# EAGLE design Zusatzplatine (EAGLE 7.4.0)
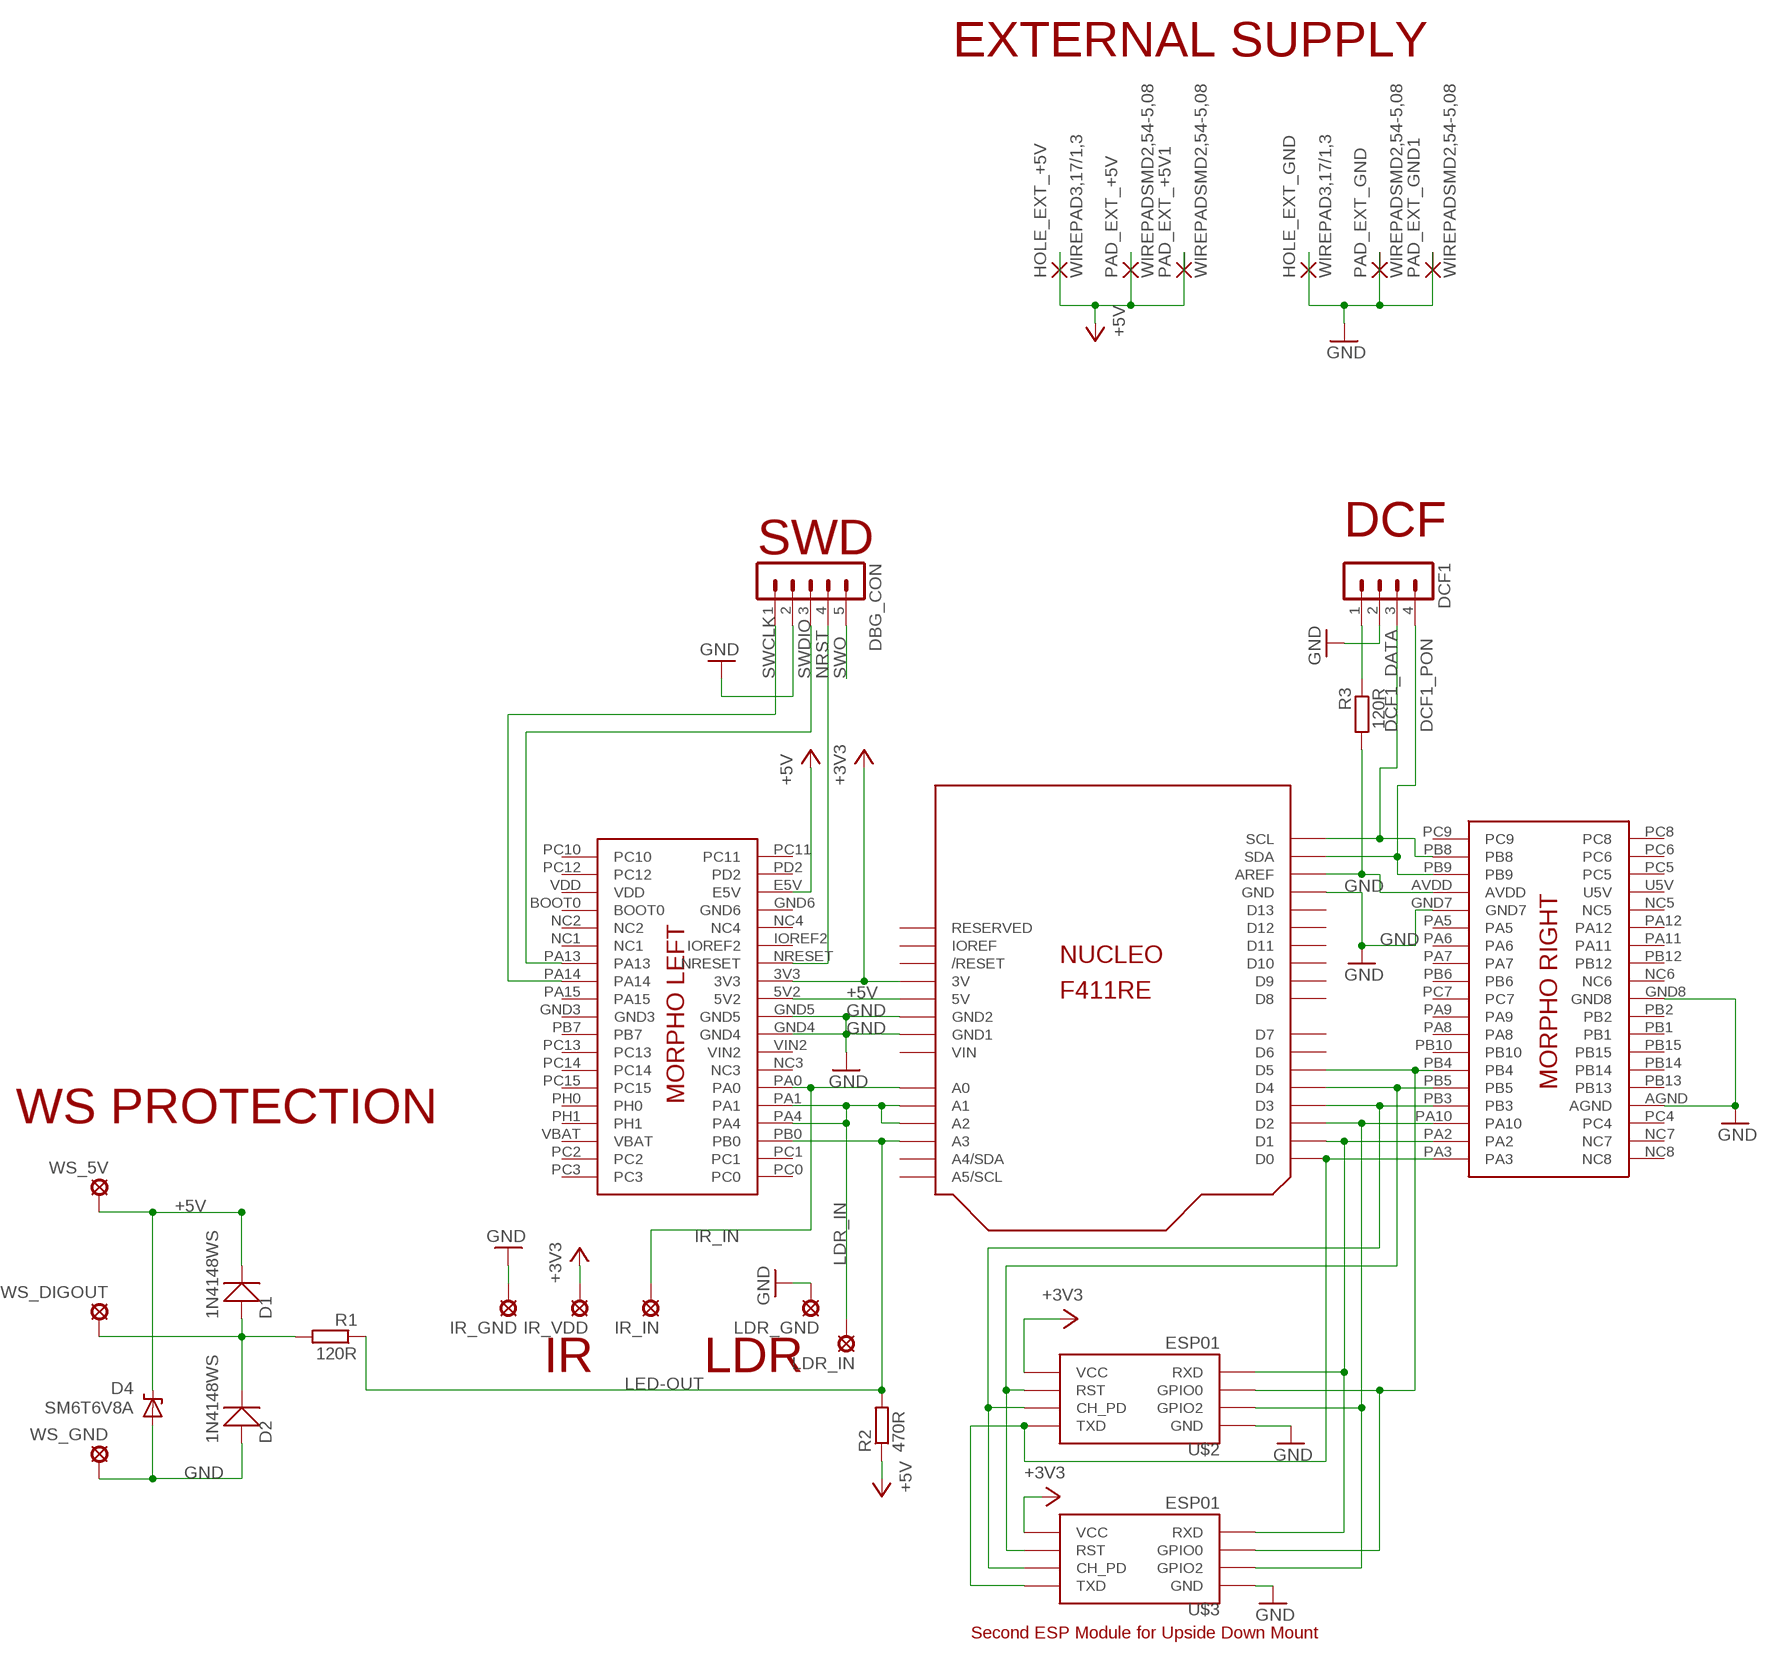
[diagram p0: schematic, sheet 1]

## Parts
D1  1N4148WS  [SOD-323]
D2  1N4148WS  [SOD-323]
D4  SM6T6V8A  SUPPRESSOR-SMBJ  [SMBJ]
DBG_CON  MA05-1  [MA05-1]
DCF1  MA04-1  [MA04-1]
HOLE_EXT_+5V  WIREPAD3,17/1,3  [3,17/1,3]
HOLE_EXT_GND  WIREPAD3,17/1,3  [3,17/1,3]
IR_GND  SE14  [SE14]
IR_IN  SE14  [SE14]
IR_VDD  SE14  [SE14]
LDR_GND  SE14  [SE14]
LDR_IN  SE14  [SE14]
PAD_EXT_+5V  WIREPADSMD2,54-5,08  [SMD2,54-5,08]
PAD_EXT_+5V1  WIREPADSMD2,54-5,08  [SMD2,54-5,08]
PAD_EXT_GND  WIREPADSMD2,54-5,08  [SMD2,54-5,08]
PAD_EXT_GND1  WIREPADSMD2,54-5,08  [SMD2,54-5,08]
R1  120R  R-EU_R1206  [R1206]
R2  470R  R-EU_R1206  [R1206]
R3  120R  R-EU_R1206  [R1206]
U$1  NUCLEO_F411RE  [NUCLEO_BRD64]
U$2  ESP01  [ESP01]
U$3  ESP01  [ESP01]
WS_5V  SE14  [SE14]
WS_DIGOUT  SE14  [SE14]
WS_GND  SE14  [SE14]

## Nets
+3V3: IR_VDD.MP U$1.3V U$1.3V3 U$2.VCC U$3.VCC
+5V: D1.1 D4.C HOLE_EXT_+5V.1(P) PAD_EXT_+5V1.1(P) PAD_EXT_+5V.1(P) R2.1 U$1.5V U$1.5V2 U$1.E5V WS_5V.MP
DCF1_DATA: DCF1.3 U$1.PB8 U$1.SCL
DCF1_PON: DCF1.4 U$1.PB9 U$1.SDA
GND: D2.0 D4.A DBG_CON.2 DCF1.2 HOLE_EXT_GND.1(P) IR_GND.MP LDR_GND.MP PAD_EXT_GND1.1(P) PAD_EXT_GND.1(P) U$1.AGND U$1.GND U$1.GND1 U$1.GND2 U$1.GND4 U$1.GND5 U$1.GND7 U$1.GND8 U$2.GND U$3.GND WS_GND.MP
IR_IN: IR_IN.MP U$1.A0 U$1.PA0
LDR_IN: LDR_IN.MP U$1.A1 U$1.A2 U$1.PA1 U$1.PA4
LED-OUT: R1.1 R2.2 U$1.A3 U$1.PB0
N$1: R3.2 U$1.AREF U$1.AVDD
N$2: DCF1.1 R3.1
N$8: D1.0 D2.1 R1.2 WS_DIGOUT.MP
N$12: U$1.D5 U$1.PB4 U$2.GPIO0 U$3.GPIO0
N$13: U$1.D4 U$1.PB5 U$2.RST U$3.RST
N$14: U$1.D3 U$1.PB3 U$2.CH_PD U$3.CH_PD
N$15: U$1.D0 U$1.PA3 U$2.TX(TXD) U$3.TX(TXD)
N$16: U$1.D1 U$1.PA2 U$2.RX(RXD) U$3.RX(RXD)
N$17: U$1.D2 U$1.PA10 U$2.GPIO2 U$3.GPIO2
NRST: DBG_CON.4 U$1.NRESET
SWCLK: DBG_CON.1 U$1.PA14
SWDIO: DBG_CON.3 U$1.PA13
SWO: DBG_CON.5
Unconnected: U$1.A4(A4/SDA) U$1.A5(A5/SCL) U$1.BOOT0 U$1.D6 U$1.D7 U$1.D8 U$1.D9 U$1.D10 U$1.D11 U$1.D12 U$1.D13 U$1.IOREF U$1.IOREF2 U$1.NC1 U$1.NC2 U$1.NC3 U$1.NC4 U$1.NC5 U$1.NC6 U$1.NC7 U$1.NC8 U$1.PA5 U$1.PA6 U$1.PA7 U$1.PA8 U$1.PA9 U$1.PA11 U$1.PA12 U$1.PA15 U$1.PB1 U$1.PB2 U$1.PB6 U$1.PB7 U$1.PB10 U$1.PB12 U$1.PB13 U$1.PB14 U$1.PB15 U$1.PC0 U$1.PC1 U$1.PC2 U$1.PC3 U$1.PC4 U$1.PC5 U$1.PC6 U$1.PC7 U$1.PC8 U$1.PC9 U$1.PC10 U$1.PC11 U$1.PC12 U$1.PC13 U$1.PC14 U$1.PC15 U$1.PD2 U$1.PH0 U$1.PH1 U$1.RESERVED U$1.RESET(/RESET)

## Notes on the sheet
- EXTERNAL SUPPLY
- DCF
- SWD
- WS PROTECTION
- IR | LDR
- Second ESP Module for Upside Down Mount

## Power pins joined to a net without a drawn wire
GND3: U$1.GND3
GND6: U$1.GND6
U5V: U$1.U5V
VBAT: U$1.VBAT
VDD: U$1.VDD
VIN: U$1.VIN
VIN2: U$1.VIN2

## Library data of the parts
D1 D2 = Diodes:1N4148WS
D4 = diode:SUPPRESSOR-: Suppressor diode
DBG_CON = con-lstb:MA05-1: PIN HEADER; OC_FARNELL: unknown; OC_NEWARK: unknown
DCF1 = con-lstb:MA04-1: PIN HEADER; OC_FARNELL: unknown; OC_NEWARK: unknown
HOLE_EXT_+5V HOLE_EXT_GND PAD_EXT_+5V PAD_EXT_+5V1 PAD_EXT_GND PAD_EXT_GND1 = wirepad:WIREPAD: Wire PAD connect wire on PCB
IR_GND IR_IN IR_VDD LDR_GND LDR_IN WS_5V WS_DIGOUT WS_GND = solpad:SE14: SOLDER PAD E1553, drill 1,4mm, distributor Buerklin, 07F820
R1-R3 = rcl:R-EU_: RESISTOR, European symbol
U$1 = Stm32nucleo:NUCLEO_F411RE
U$2 U$3 = esp8266modules:ESP01: ESP8266 Wifi module 01

## Board
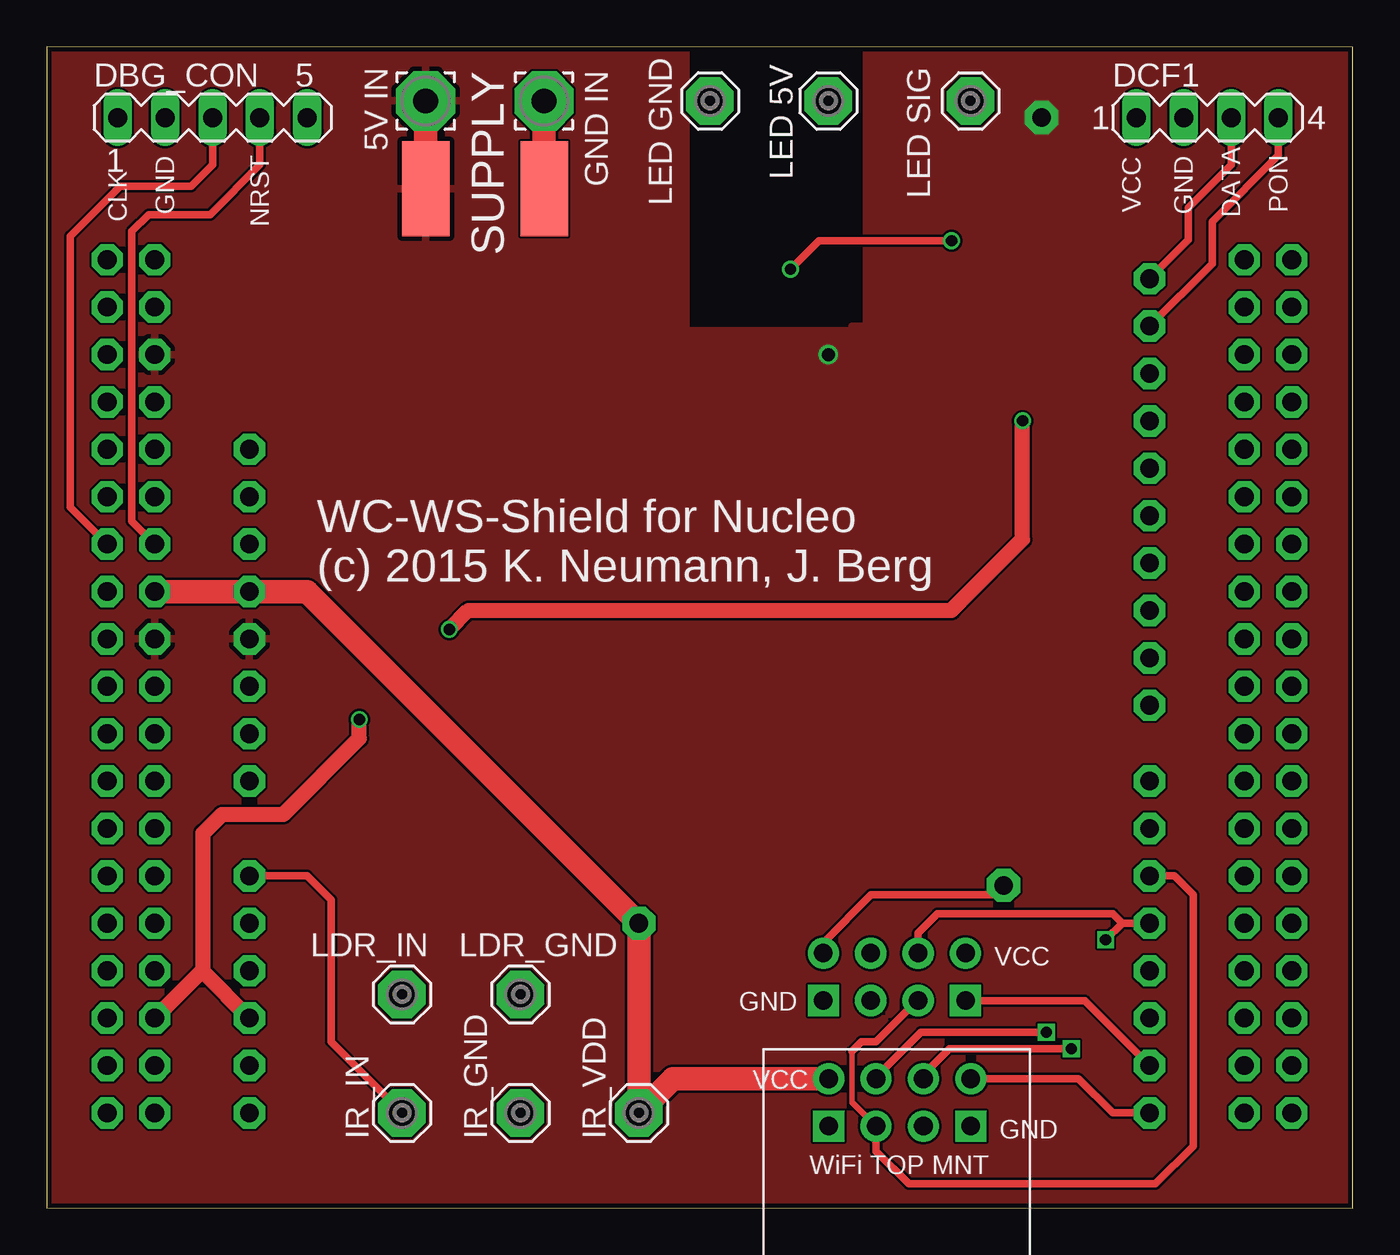
[diagram p1: board, top side]
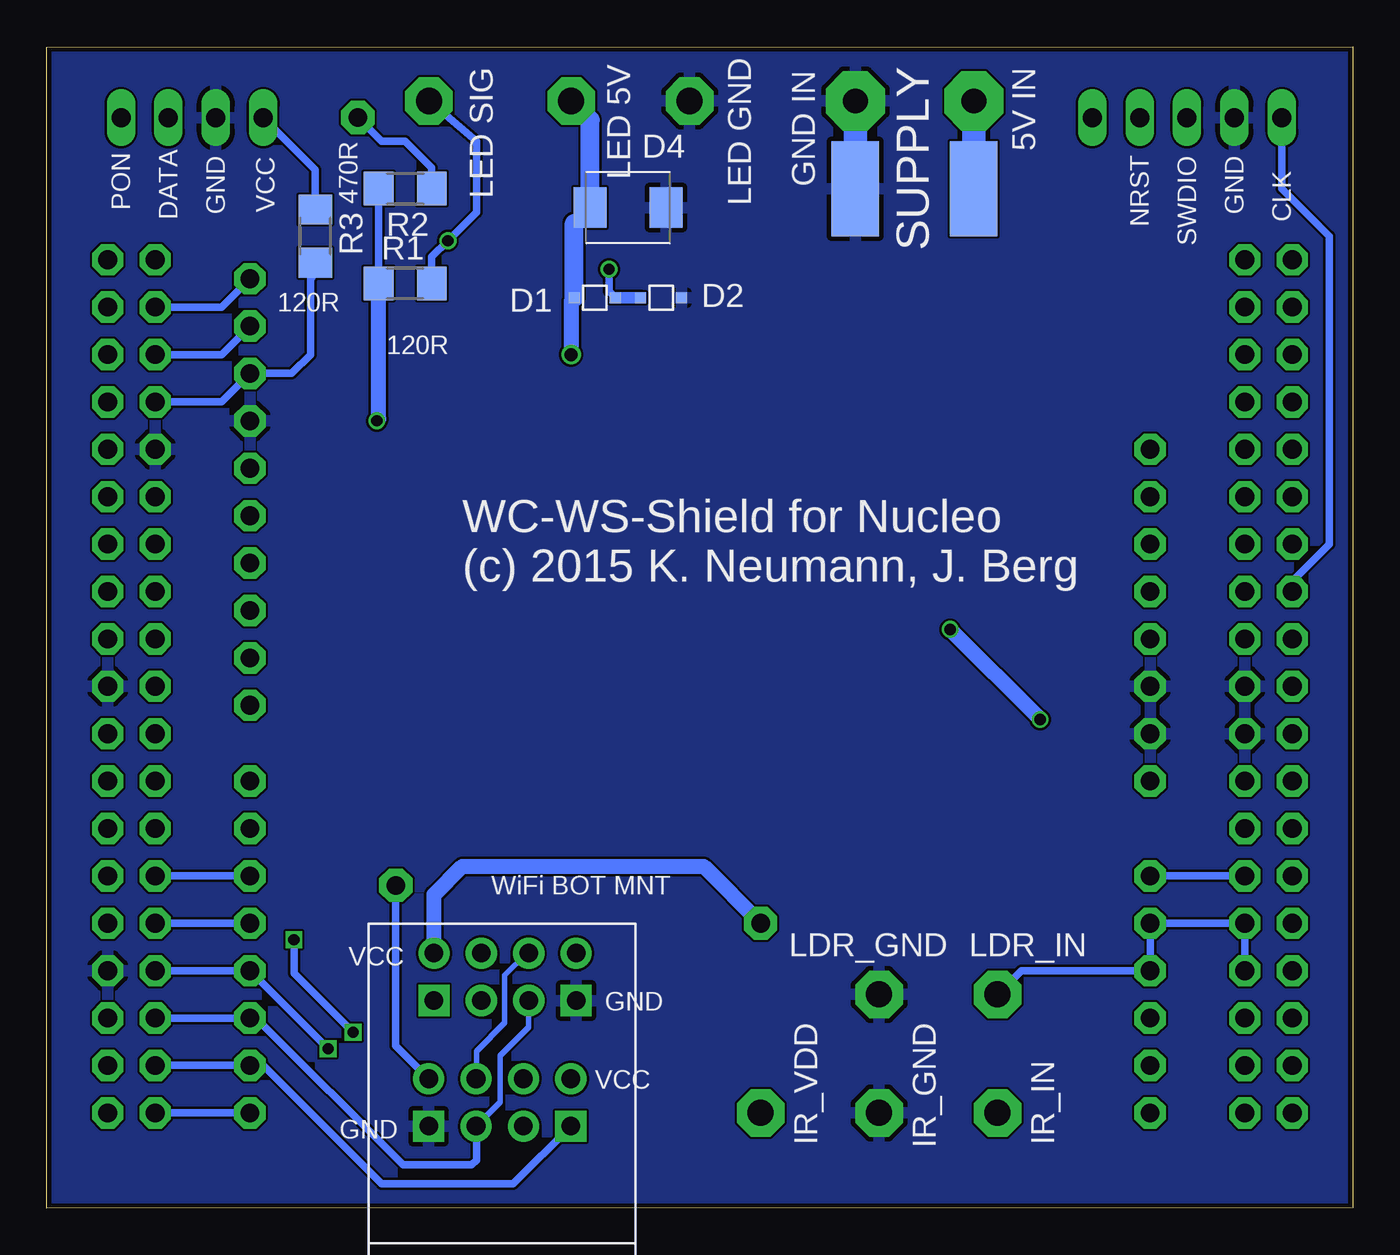
[diagram p2: board, bottom side, seen from below]

Size 70.03 x 62.24 mm. Coordinates in mm from the lower left corner, seen from the top.
Outline: 0,0.02 70.03,0 70.03,62.22 0,62.24 0,0.02
Copper layers (1*16): Top 0.035mm / dielectric 1.5mm / Bottom 0.035mm
Design rules "dirt_cheap_dirty_boards.v1": minimum track width 5mil, minimum drill 12mil, track to track 5mil, track to pad 5mil, pad to pad 5mil, via to via 5mil, smd to smd 0mil, copper to edge 10mil, drill to drill 10mil, minimum pad ring 10mil, minimum via ring 6mil, stop-mask expansion 2mil, vias tented up to drill 25mil, thermal gap 10mil

### Footprints (pad centres in the part's own frame; a part is rotated, then mirrored left to right if it is on the bottom)
SOD-323 = smd 0.6 x 0.6: 0 -1.1,0; 1 1.1,0
SMBJ = smd 1.78 x 2.16: A 2.04,0; C -2.03,0
MA05-1 = drill 1.016 long: 1 -5.08,0; 2 -2.54,0; 3 0,0; 4 2.54,0; 5 5.08,0
MA04-1 = drill 1.016 long: 1 -3.81,0; 2 -1.27,0; 3 1.27,0; 4 3.81,0
3,17/1,3 = drill 1.321 pad 3.175 octagon: 1 0,0
SE14 = drill 1.397 pad 2.54 octagon: MP 0,0
SMD2,54-5,08 = smd 2.54 x 5.08: 1 0,0
R1206 = smd 1.6 x 1.803: 1 -1.422,0; 2 1.422,0
NUCLEO_BRD64 = drill 1 pad 1.676 octagon: 3V 10.87,33.02; 3V3 5.79,33.02; 5V 10.87,30.48; 5V2 5.79,30.48; A0 10.87,17.78; A1 10.87,15.24; A2 10.87,12.7; A3 10.87,10.16; A4 10.87,7.62; A5 10.87,5.08; AGND 66.75,12.7; AREF 59.13,44.704; AVDD 64.21,43.18; BOOT0 3.25,43.18; D0 59.13,5.08; D1 59.13,7.62; D2 59.13,10.16; D3 59.13,12.7; D4 59.13,15.24; D5 59.13,17.78; D6 59.13,20.32; D7 59.13,22.86; D8 59.13,26.924; D9 59.13,29.464; D10 59.13,32.004; D11 59.13,34.544; D12 59.13,37.084; D13 59.13,39.624; E5V 5.79,45.72; GND 59.13,42.164; GND1 10.87,25.4; GND2 10.87,27.94; GND3 3.25,27.94; GND4 5.79,25.4; GND5 5.79,27.94; GND6 5.79,43.18; GND7 64.21,40.64; GND8 66.75,27.94; IOREF 10.87,38.1; IOREF2 5.79,38.1; NC1 3.25,38.1; NC2 3.25,40.64; NC3 5.79,20.32; NC4 5.79,40.64; NC5 66.75,40.64; NC6 66.75,30.48; NC7 66.75,7.62; NC8 66.75,5.08; NRESET 5.79,35.56; PA0 5.79,17.78; PA1 5.79,15.24; PA2 64.21,7.62; PA3 64.21,5.08; PA4 5.79,12.7; PA5 64.21,38.1; PA6 64.21,35.56; PA7 64.21,33.02; PA8 64.21,22.86; PA9 64.21,25.4; PA10 64.21,10.16; PA11 66.75,35.56; PA12 66.75,38.1; PA13 3.25,35.56; PA14 3.25,33.02; PA15 3.25,30.48; PB0 5.79,10.16; PB1 66.75,22.86; PB2 66.75,25.4; PB3 64.21,12.7; PB4 64.21,17.78; PB5 64.21,15.24; PB6 64.21,30.48; PB7 3.25,25.4; PB8 64.21,48.26; PB9 64.21,45.72; PB10 64.21,20.32; PB12 66.75,33.02; PB13 66.75,15.24; PB14 66.75,17.78; PB15 66.75,20.32; PC0 5.79,5.08; PC1 5.79,7.62; PC2 3.25,7.62; PC3 3.25,5.08; PC4 66.75,10.16; PC5 66.75,45.72; PC6 66.75,48.26; PC7 64.21,27.94; PC8 66.75,50.8; PC9 64.21,50.8; PC10 3.25,50.8; PC11 5.79,50.8; PC12 3.25,48.26; PC13 3.25,22.86; PC14 3.25,20.32; PC15 3.25,17.78; PD2 5.79,48.26; PH0 3.25,15.24; PH1 3.25,12.7; RESERVED 10.87,40.64; RESET 10.87,35.56; SCL 59.13,49.784; SDA 59.13,47.244; U5V 66.75,43.18; VBAT 3.25,10.16; VDD 3.25,45.72; VIN 10.87,22.86; VIN2 5.79,22.86
ESP01 = drill 1 pad 1.676: CH_PD -1.285,-8.178; GPIO0 1.255,-5.638; GPIO2 -1.285,-5.638; RST 1.255,-8.178; TX -3.825,-8.178; VCC 3.795,-8.178 | drill 1 pad 1.676 square: GND -3.825,-5.638; RX 3.795,-5.638

### Placement (x,y rotation side)
D1  40.64,48.79 180 bottom
D2  37.08,48.79 180 bottom
D4  38.86,53.62 0 bottom
DBG_CON  8.89,58.44 0 top
DCF1  62.23,58.44 0 top
HOLE_EXT_+5V  20.32,59.33 90 top
HOLE_EXT_GND  26.67,59.33 90 top
IR_GND  25.4,5.1 90 top
IR_IN  19.05,5.1 90 top
IR_VDD  31.75,5.1 90 top
LDR_GND  25.4,11.45 90 top
LDR_IN  19.05,11.45 90 top
PAD_EXT_+5V  20.32,54.63 0 bottom
PAD_EXT_+5V1  20.32,54.63 0 top
PAD_EXT_GND  26.67,54.63 0 top
PAD_EXT_GND1  26.67,54.63 0 bottom
R1  50.8,49.55 0 bottom
R2  50.8,54.63 180 bottom
R3  55.63,52.09 270 bottom
U$1  0,0.02 0 top
U$2  45.72,-1.25 180 top
U$3  45.47,5.49 180 bottom
WS_5V  41.91,59.33 0 top
WS_DIGOUT  49.53,59.33 0 top
WS_GND  35.56,59.33 0 top

### Tracks (layer width: path | path; a pad name or v marks a point on that pad's centre or on a via)
+3V3  (via drill 1 pad 1.78)
  Top 1.27: U$1.3V3 U$1.3V 13.97,33.04 31.5,15.52 v31.75,15.26 IR_VDD.MP 33.58,6.93 U$2.VCC
  Bottom 0.813: U$3.VCC 49.26,16.8 47.75,18.31 34.8,18.31 v31.75,15.26
+5V  (via drill 0.7, 1 pad 1.78)
  Top 1.27: PAD_EXT_+5V1.1 HOLE_EXT_+5V.1
  Bottom 0.406: R2.1 49.38,55.75 50.8,57.17 52.07,57.17 v53.34,58.44 | D1.1 41.91,48.62
  Bottom 0.813: 41.91,48.62 v41.91,45.74 | 41.74,52.77 D4.C
  Bottom 1.016: D1.1 41.74,52.77 | D4.C 40.89,58.32 WS_5V.MP
  Bottom 1.27: HOLE_EXT_+5V.1 PAD_EXT_+5V1.1
  pour Top: 0,62.25 34.29,62.25 34.29,47.01 43.18,47.01 43.18,47.27 43.94,47.27 43.94,62.25 69.85,62.25 70.1,0.15 0,0.02
DCF1_DATA
  Top 0.406: DCF1.3 63.5,55.9 61.21,53.62 61.21,51.89 U$1.SCL
  Bottom 0.406: U$1.PB8 60.65,48.28 U$1.SCL
DCF1_PON
  Top 0.406: DCF1.4 66.04,56.41 62.48,52.86 62.48,50.62 U$1.SDA
  Bottom 0.406: U$1.PB9 60.65,45.74 U$1.SDA
GND
  Top 1.27: HOLE_EXT_GND.1 PAD_EXT_GND1.1
  Bottom 1.27: HOLE_EXT_GND.1 PAD_EXT_GND1.1
  pour Bottom: 0,62.25 0,0.02 69.85,0.02 69.85,62.25
IR_IN
  Top 0.406: U$1.A0 13.97,17.8 15.24,16.53 15.24,8.91 IR_IN.MP
  Bottom 0.406: U$1.A0 U$1.PA0
LDR_IN
  Bottom 0.406: LDR_IN.MP 17.78,12.72 U$1.A2 U$1.A1 U$1.PA1 U$1.PA4
LED-OUT  (via drill 0.6)
  Top 0.813: U$1.A3 8.38,12.67 | 8.38,12.67 8.38,20.09 9.4,21.11 12.7,21.11 16.76,25.17 v16.76,26.19 | v21.59,31.01 22.61,32.03 48.51,32.03 52.32,35.84 v52.32,42.19 | 8.38,12.67 8.28,12.67 U$1.PB0
  Bottom 0.406: R2.2 R1.1
  Bottom 0.813: v16.76,26.19 v21.59,31.01 | v52.32,42.19 52.22,42.29 R1.1
N$1
  Bottom 0.406: 55.88,50.82 55.88,49.81 | 55.88,49.81 55.88,45.74 56.9,44.73 U$1.AREF 60.65,43.2 U$1.AVDD | R3.2 55.63,50.06 55.88,49.81
N$2
  Bottom 0.406: R3.1 55.63,55.65 DCF1.1
N$8  (via drill 0.6)
  Top 0.406: v39.88,50.32 41.4,51.84 v48.51,51.84
  Bottom 0.406: R1.2 49.38,50.98 v48.51,51.84 46.99,53.36 46.99,57.17 WS_DIGOUT.MP | D1.0 39.88,49.13 v39.88,50.32
  Bottom 0.61: D2.1 D1.0
N$12
  Top 0.305: 43.18,8.41 43.18,5.68 U$2.GPIO0
  Top 0.406: U$2.GPIO0 44.47,3.06 46.23,1.29 59.44,1.29 61.47,3.33 61.47,16.79 60.45,17.8 U$1.D5 | U$3.GPIO0 46.66,11.12 44.45,8.91 43.69,8.91 43.18,8.41
  Bottom 0.406: U$1.PB4 U$1.D5
N$13  (via drill 0.6)
  Top 0.406: U$2.RST 44.47,7.02 46.86,9.42 v53.59,9.42 | v56.77,14.38 57.66,15.26 | 57.66,15.26 U$1.D4 | U$3.RST 46.72,14.74 47.75,15.77 57.15,15.77 57.66,15.26
  Bottom 0.406: v53.59,9.42 56.77,12.6 v56.77,14.38 | U$1.PB5 U$1.D4
N$14  (via drill 0.6)
  Top 0.406: U$2.CH_PD 47.01,7.15 48.39,8.53 v54.94,8.53
  Bottom 0.305: U$3.CH_PD 44.27,13.66 45.47,12.47 45.47,9.93 46.99,8.41 46.99,6.95 U$2.CH_PD
  Bottom 0.406: v54.94,8.53 U$1.D3 U$1.PB3
N$15  (via drill 1 pad 1.78)
  Top 0.406: U$2.TX 55.32,6.93 57.15,5.1 U$1.D0 | U$3.TX 41.64,14.23 44.2,16.79 50.8,16.79 v51.31,17.3
  Bottom 0.406: v51.31,17.3 51.31,8.7 U$2.TX | U$1.PA3 U$1.D0
N$16
  Top 0.406: U$3.RX 55.65,11.12 U$1.D1
  Bottom 0.406: U$2.RX 45.02,1.29 52.07,1.29 58.42,7.64 U$1.D1 U$1.PA2
N$17
  Bottom 0.305: U$3.GPIO2 44.18,9.69 45.72,8.15 45.72,5.68 U$2.GPIO2
  Bottom 0.406: U$2.GPIO2 46.99,4.38 46.99,2.56 47.24,2.31 50.93,2.31 58.8,10.18 U$1.D2 U$1.PA10
NRST
  Top 0.406: DBG_CON.4 11.43,55.9 8.76,53.24 5.46,53.24 4.57,52.35 4.57,36.8 U$1.NRESET
SWCLK
  Bottom 0.406: DBG_CON.1 3.81,54.63 1.27,52.09 1.27,35.58 3.25,33.6 U$1.PA14
SWDIO
  Top 0.406: DBG_CON.3 8.89,55.9 7.75,54.76 3.94,54.76 1.27,52.09 1.27,37.56 U$1.PA13

### Text on the board
tNames: 5V IN | GND | GND | GND IN | LED 5V | LED GND | LED SIG | CLK | NRST | VCC | DATA | PON | SUPPLY | WC-WS-Shield for Nucleo / (c) 2015 K. Neumann, J. Berg | VCC | GND | VCC | GND | WiFi TOP MNT
bNames: 5V IN | 470R | GND | GND | GND IN | LED 5V | LED GND | LED SIG | CLK | NRST | VCC | DATA | PON | SWDIO | SUPPLY | 120R | 120R | WC-WS-Shield for Nucleo / (c) 2015 K. Neumann, J. Berg | WiFi BOT MNT | LDR_IN | LDR_GND | VCC | GND | IR_GND | IR_VDD | IR_IN | VCC | GND
tDocu: SWDIO | NRST | VCC